# Altium schematic sheet Top Sheet.SchDoc
size A4
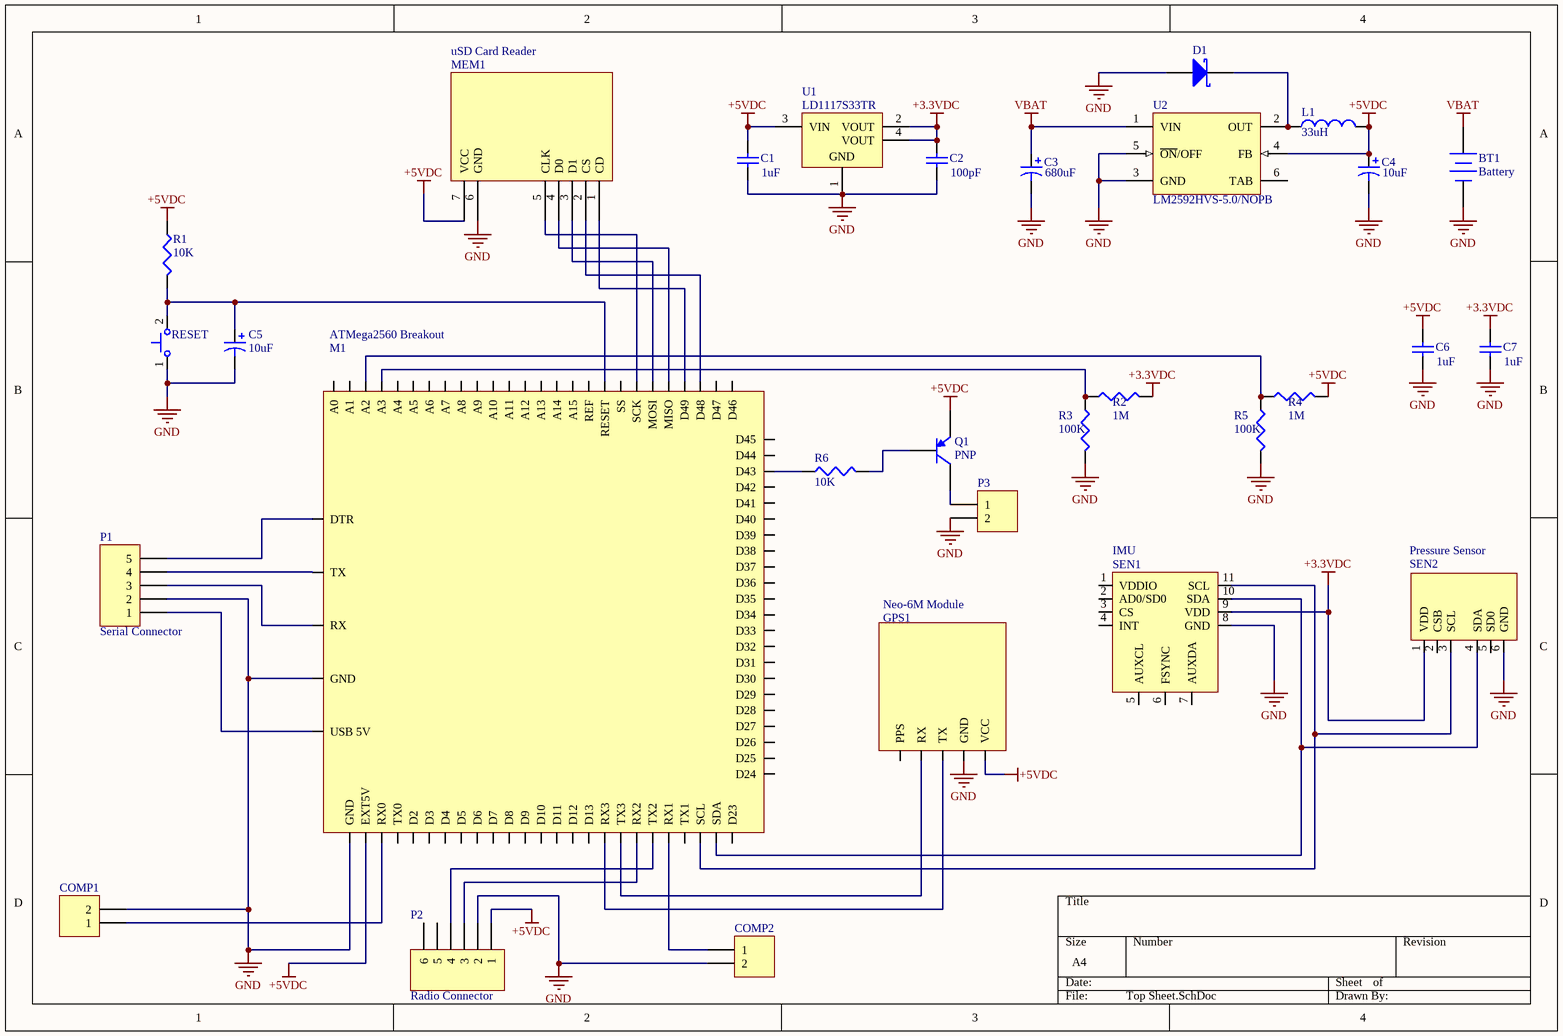
[diagram p0: Top Sheet.SchDoc]

## Parts
BT1  Battery  [BAT-2]
C1  value 1uF  [C1206]  (hidden comment: Cap Semi)
C2  value 100pF  [C1206]  (hidden comment: Cap Semi)
C3  value 680uF  [RB5-10.5]  (hidden comment: Cap Pol3)
C4  value 10uF  [RB5-10.5]  (hidden comment: Cap Pol3)
C5  value 10uF  [C0805]  (hidden comment: Cap Pol3)
C6  value 1uF  [C1206]  (hidden comment: Cap Semi)
C7  value 1uF  [C1206]  (hidden comment: Cap Semi)
COMP1  Header 2  [HDR1X2]  (value not drawn)
COMP2  Header 2  [HDR1X2]  (value not drawn)
D1  D Schottky  [SMB]  (value not drawn)
GPS1  Neo-6M Module  [Neo-6M GPS Module]
L1  value 33uH  [Inductor]  (hidden comment: Inductor)
M1  ATMega2560 Breakout  [ATMEGA2560 Breakout]
MEM1  uSD Card Reader  [uSD Card Reader]
P1  Serial Connector  [HDR1X5]
P2  Radio Connector  [HDR1X6]
P3  Header 2  [HDR1X2]  (value not drawn)
Q1  PNP  [SOT-23B_N]
R1  value 10K  [6-0805_L]  (hidden comment: Res3)
R2  value 1M  [6-0805_L]  (hidden comment: Res3)
R3  value 100K  [6-0805_L]  (hidden comment: Res3)
R4  value 1M  [6-0805_L]  (hidden comment: Res3)
R5  value 100K  [6-0805_L]  (hidden comment: Res3)
R6  value 10K  [6-0805_L]  (hidden comment: Res3)
RESET  KSS221GLFS  [KSS-2G]  (value not drawn)
SEN1  IMU  [Sparkfun IMU]
SEN2  Pressure Sensor  [Barometric Pressure Sensor]
U1  LD1117S33TR  [SOT-223_N]
U2  LM2592HVS-5.0/NOPB  [TS5B_N]

## Nets
+3.3VDC: C2.2 C7.2 R2.2 SEN1.9(VDD) SEN2.1(VDD) U1.2(VOUT) U1.4(VOUT)
+5VDC: C1.2 C4.1 C6.2 GPS1.5(VCC) L1.2 M1.EXT5V MEM1.7(VCC) P2.1 Q1.3(E) R1.1 R4.2 U1.3(VIN) U2.4(FB)
GND: BT1.2(-) C1.1 C2.1 C3.2 C4.2 C5.2 C6.1 C7.1 COMP1.2 COMP2.2 D1.1(A) GPS1.4(GND) M1.GND MEM1.6(GND) P1.2 P2.2 P3.2 R3.2 R5.2 RESET.1 SEN1.8(GND) SEN2.6(GND) U1.1(GND) U2.3(GND) U2.5(~{ON}/OFF)
VBAT: BT1.1(+) C3.1 U2.1(VIN)
NetC5_1: C5.1 M1.RESET R1.2 RESET.2
NetCOMP1_1: COMP1.1 M1.RX0
NetCOMP2_1: COMP2.1 M1.RX1
NetD1_2: D1.2(K) L1.1 U2.2(OUT)
NetGPS1_2: GPS1.2(RX) M1.TX3
NetGPS1_3: GPS1.3(TX) M1.RX3
NetM1_43: M1.43(D43) R6.1
NetM1_48: M1.48(D48) MEM1.2(CS)
NetM1_49: M1.49(D49) MEM1.1(CD)
NetM1_A2: M1.A2 R4.1 R5.1
NetM1_A3: M1.A3 R2.1 R3.1
NetM1_DTR: M1.DTR P1.5
NetM1_MISO: M1.MISO MEM1.4(D0)
NetM1_MOSI: M1.MOSI MEM1.3(D1)
NetM1_RX: M1.RX P1.3
NetM1_RX2: M1.RX2 P2.3
NetM1_SCK: M1.SCK MEM1.5(CLK)
NetM1_SCL: M1.SCL SEN1.11(SCL) SEN2.3(SCL)
NetM1_SDA: M1.SDA SEN1.10(SDA) SEN2.4(SDA)
NetM1_TX: M1.TX P1.4
NetM1_TX2: M1.TX2 P2.4
NetM1_USB 5V: M1.USB_5V P1.1
NetP3_1: P3.1 Q1.1(C)
NetQ1_2: Q1.2(B) R6.2

Not connected (* = marked no-connect by the designer): GPS1 1(PPS); M1 2(D2) 3(D3) 4(D4) 5(D5) 6(D6) 7(D7) 8(D8) 9(D9) 10(D10) 11(D11) 12(D12) 13(D13) 23(D23) 24(D24) 25(D25) 26(D26) 27(D27) 28(D28) 29(D29) 30(D30) 31(D31) 32(D32) 33(D33) 34(D34) 35(D35) 36(D36) 37(D37) 38(D38) 39(D39) 40(D40) 41(D41) 42(D42) 44(D44) 45(D45) 46(D46) 47(D47) A0 A1 A4 A5 A6 A7 A8 A9 A10 A11 A12 A13 A14 A15 REF SS TX0 TX1; P2 5 6; SEN1 1(VDDIO) 2(AD0/SD0) 3(CS) 4(INT) 5(AUXCL) 6(FSYNC) 7(AUXDA); SEN2 2(CSB) 5(SD0); U2 6(TAB)

## Library data of the parts
BT1 = Battery: Multicell Battery; Published: 24-Mar-1999; LatestRevisionDate: 17-Jul-2002; LatestRevisionNote: Re-released for DXP Platform.; PackageReference: BAT-2; Publisher: Altium Limited; PackageDescription: Battery; 2 Leads
C1 C2 C6 C7 = Cap Semi: Capacitor (Semiconductor SIM Model); Published: 8-Jun-2000; LatestRevisionDate: 29-May-2009; LatestRevisionNote: IPC-7351 Footprint Added.; PackageReference: C1206; Publisher: Altium Limited; PackageDescription: Chip Capacitor
C3-C5 = Cap Pol3: Polarized Capacitor (Surface Mount); Published: 8-Jun-2000; LatestRevisionDate: 29-May-2009; LatestRevisionNote: IPC-7351 Footprint Added.; PackageReference: C0805; Publisher: Altium Limited; PackageDescription: Chip Capacitor
COMP1 COMP2 P3 = Header 2: Header, 2-Pin; LatestRevisionDate: 17-Jul-2002; LatestRevisionNote: Re-released for DXP Platform.; Publisher: Altium Limited
D1 = D Schottky: Schottky Diode; Published: 8-Jun-2000; LatestRevisionDate: 17-Jul-2002; LatestRevisionNote: Re-released for DXP Platform.; PackageReference: SMB; Publisher: Altium Limited; PackageDescription: DO-214-AA/SMB; 2 C-Bend Leads; Body 5.3 x 3.6 mm, inc. leads (LxW); Code_JEDEC: DO-214-AA
GPS1 = Neo-6M Module: Serial GPS module
L1 = Inductor: Code_IEC: 1005; Published: 8-Jun-2000; LatestRevisionDate: 29-May-2009; LatestRevisionNote: IPC-7351 Footprint Added.; PackageReference: 0402-A; Publisher: Altium Limited; PackageDescription: Chip Inductor; Code_JEITA: 0402
M1 = ATMega2560 Breakout: Tindie's breakout board for the ATMega2560
MEM1 = uSD Card Reader: SPI interface micro SD card reader from sparkfun.; Date created: July 29, 2018
P1 = Header 5: Header, 5-Pin; LatestRevisionDate: 17-Jul-2002; LatestRevisionNote: Re-released for DXP Platform.; Publisher: Altium Limited
P2 = Header 6: Header, 6-Pin; LatestRevisionDate: 17-Jul-2002; LatestRevisionNote: Re-released for DXP Platform.; Publisher: Altium Limited
Q1 = PNP: PNP Bipolar Transistor; Published: 8-Jun-2000; LatestRevisionDate: 29-May-2009; LatestRevisionNote: IPC-7351 Footprint Added.; PackageVersion: Aug-1999; PackageReference: SOT-23B; Publisher: Altium Limited; PackageDescription: 3-Pin SOT-23 Package 0.95 mm Pitch, 2.4 mm Lead Span
R1-R6 = Res3: Resistor; Published: 8-Jun-2000; LatestRevisionDate: 29-May-2009; LatestRevisionNote: IPC-7351 Footprint Added.; PackageReference: J1-0603; Publisher: Altium Limited; PackageDescription: Chip Resistor
RESET = KSS221GLFS: Switch, Subminiature Side-Actuated Tact, SMT, KSS Series, Std Actuator, 2 Gull Wing Leads, SPST, 2N Force, Silver Contact; PCB_Layout: Complies with manufacturer's recommendation.; Published: 14-Mar-2008; DatasheetVersion: Aug-2007; PackageVersion: Aug-2007; PackageReference: KSS-2G; Publisher: Altium Limited; PackageDescription: Subminiature SMT Side Actuated Switch, Body 7 x 3.5 mm (LxW); ComponentLink1Description: Manufacturer Link; ComponentLink1URL: http://www.ck-components.com/; ComponentLink2Description: Datasheet; ComponentLink2URL: http://www.ck-components.com/media/pdf/catalogs/Tactile_Switches%5CKSS_series_Tactile_August_2007.pdf
SEN1 = Inertial Measurement Unit: MPU-9250 breakout board from sparkfun.
SEN2 = Baromateric Pressure Sensor: MS5611-01BA03 Barometric Pressure Sensor, Variometer.
U1 = LD1117S33TR: Fixed Low Drop Positive Voltage Regulator, 3.3V, 4-Pin SOT-223, Tape and Reel; DatasheetVersion: Nov-2011; PackageVersion: 2010; PackageReference: SOT-223; PackageDescription: 4-Pin SOT-223 Package, 6.5 x 3.5 mm Body, 2.3 mm Pitch, 7 mm Lead Span; PartNumber: LD1117S33TR; ComponentLink1Description: Manufacturer URL; ComponentLink1URL: http://www.st.com; ComponentLink2Description: Datasheet; ComponentLink2URL: http://www.st.com/internet/com/TECHNICAL_RESOURCES/TECHNICAL_LITERATURE/DATASHEET/CD00000544.pdf
U2 = LM2592HVS-5.0/NOPB: SIMPLE SWITCHER® Power Converter 150 KHz 2A Step-Down Voltage Regulator, 5-pin TO-263, Pb-Free; Manufacturer: National Semiconductor; PackageTopMarking: NSUZXYTTE#*LM2592HVS*-5.0 P+; PowerWise: N; Published: 1-Mar-2010; DatasheetVersion: Aug-2001; PackageVersion: revD, Apr-2005; PackageReference: TS5B; Publisher: Altium Limited; PackageDescription: TO-263, Molded, .400 x .390 x .180in, 5 Lead, .067in Pitch, Surface Mount; Supplier 1: Digi-Key; Supplier Part Number 1: LM2592HVS-5.0-ND; Supplier 2: Farnell; Supplier Part Number 2: 1469187; PartNumber: LM2592HVS-5.0/NOPB; RoHS: Y; PinCount: 5; CompType: Switcher; Code_JEDEC: MO-169-AB; ComponentLink1Description: LM2592HV Datasheet; ComponentLink1URL: http://www.national.com/ds/LM/LM2592HV.pdf; ComponentLink2Description: LM2592HV Web Page; ComponentLink2URL: http://www.national.com/pf/LM/LM2592HV.html; ComponentLink3Description: TS5B Package Page; ComponentLink3URL: http://www.national.com/packaging/folders/ts5b.html